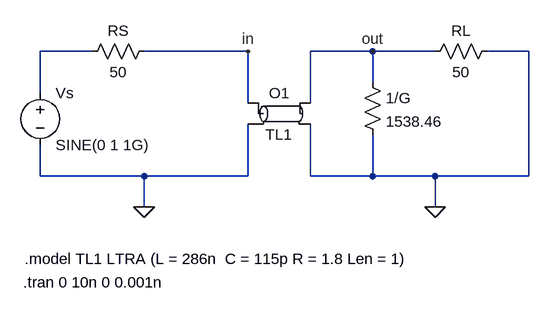
[diagram p0: schematic exercise1_assignment6.asc]
exercise1_assignment6.asc, the LTspice schematic file:
Version 4
SHEET 1 880 680
WIRE -48 16 -128 16
WIRE 192 16 32 16
WIRE 384 16 288 16
WIRE 480 16 384 16
WIRE 624 16 560 16
WIRE 384 64 384 16
WIRE -128 80 -128 16
WIRE 192 96 192 16
WIRE 288 96 288 16
WIRE -128 208 -128 160
WIRE 32 208 -128 208
WIRE 192 208 192 128
WIRE 192 208 32 208
WIRE 288 208 288 128
WIRE 384 208 384 144
WIRE 384 208 288 208
WIRE 480 208 384 208
WIRE 624 208 624 16
WIRE 624 208 480 208
WIRE 32 256 32 208
WIRE 480 256 480 208
FLAG 480 256 0
FLAG 32 256 0
FLAG 384 16 out
FLAG 192 16 in
SYMBOL ltline 240 112 R0
SYMATTR InstName O1
SYMATTR Value TL1
SYMBOL res 368 48 R0
SYMATTR InstName 1/G
SYMATTR Value 1538.46
SYMBOL res 576 0 R90
WINDOW 0 0 56 VBottom 2
WINDOW 3 32 56 VTop 2
SYMATTR InstName RL
SYMATTR Value 50
SYMBOL res 48 0 R90
WINDOW 0 0 56 VBottom 2
WINDOW 3 32 56 VTop 2
SYMATTR InstName RS
SYMATTR Value 50
SYMBOL voltage -128 64 R0
WINDOW 123 0 0 Left 0
WINDOW 39 0 0 Left 0
SYMATTR InstName Vs
SYMATTR Value SINE(0 1 1G)
TEXT -152 336 Left 2 !.model TL1 LTRA (L = 286n  C = 115p R = 1.8 Len = 1)
TEXT -154 372 Left 2 !.tran 0 10n 0 0.001n

The netlist it stands for:
* exercise1_assignment6.asc
O1 in 0 out 0 TL1
R§1/G out 0 1538.46
RL 0 out 50
RS in N001 50
Vs N001 0 SINE(0 1 1G)
.model TL1 LTRA (L = 286n  C = 115p R = 1.8 Len = 1)
.tran 0 10n 0 0.001n
.backanno
.end